# EAGLE design arm controller single v1.1 (EAGLE 9.5.2)
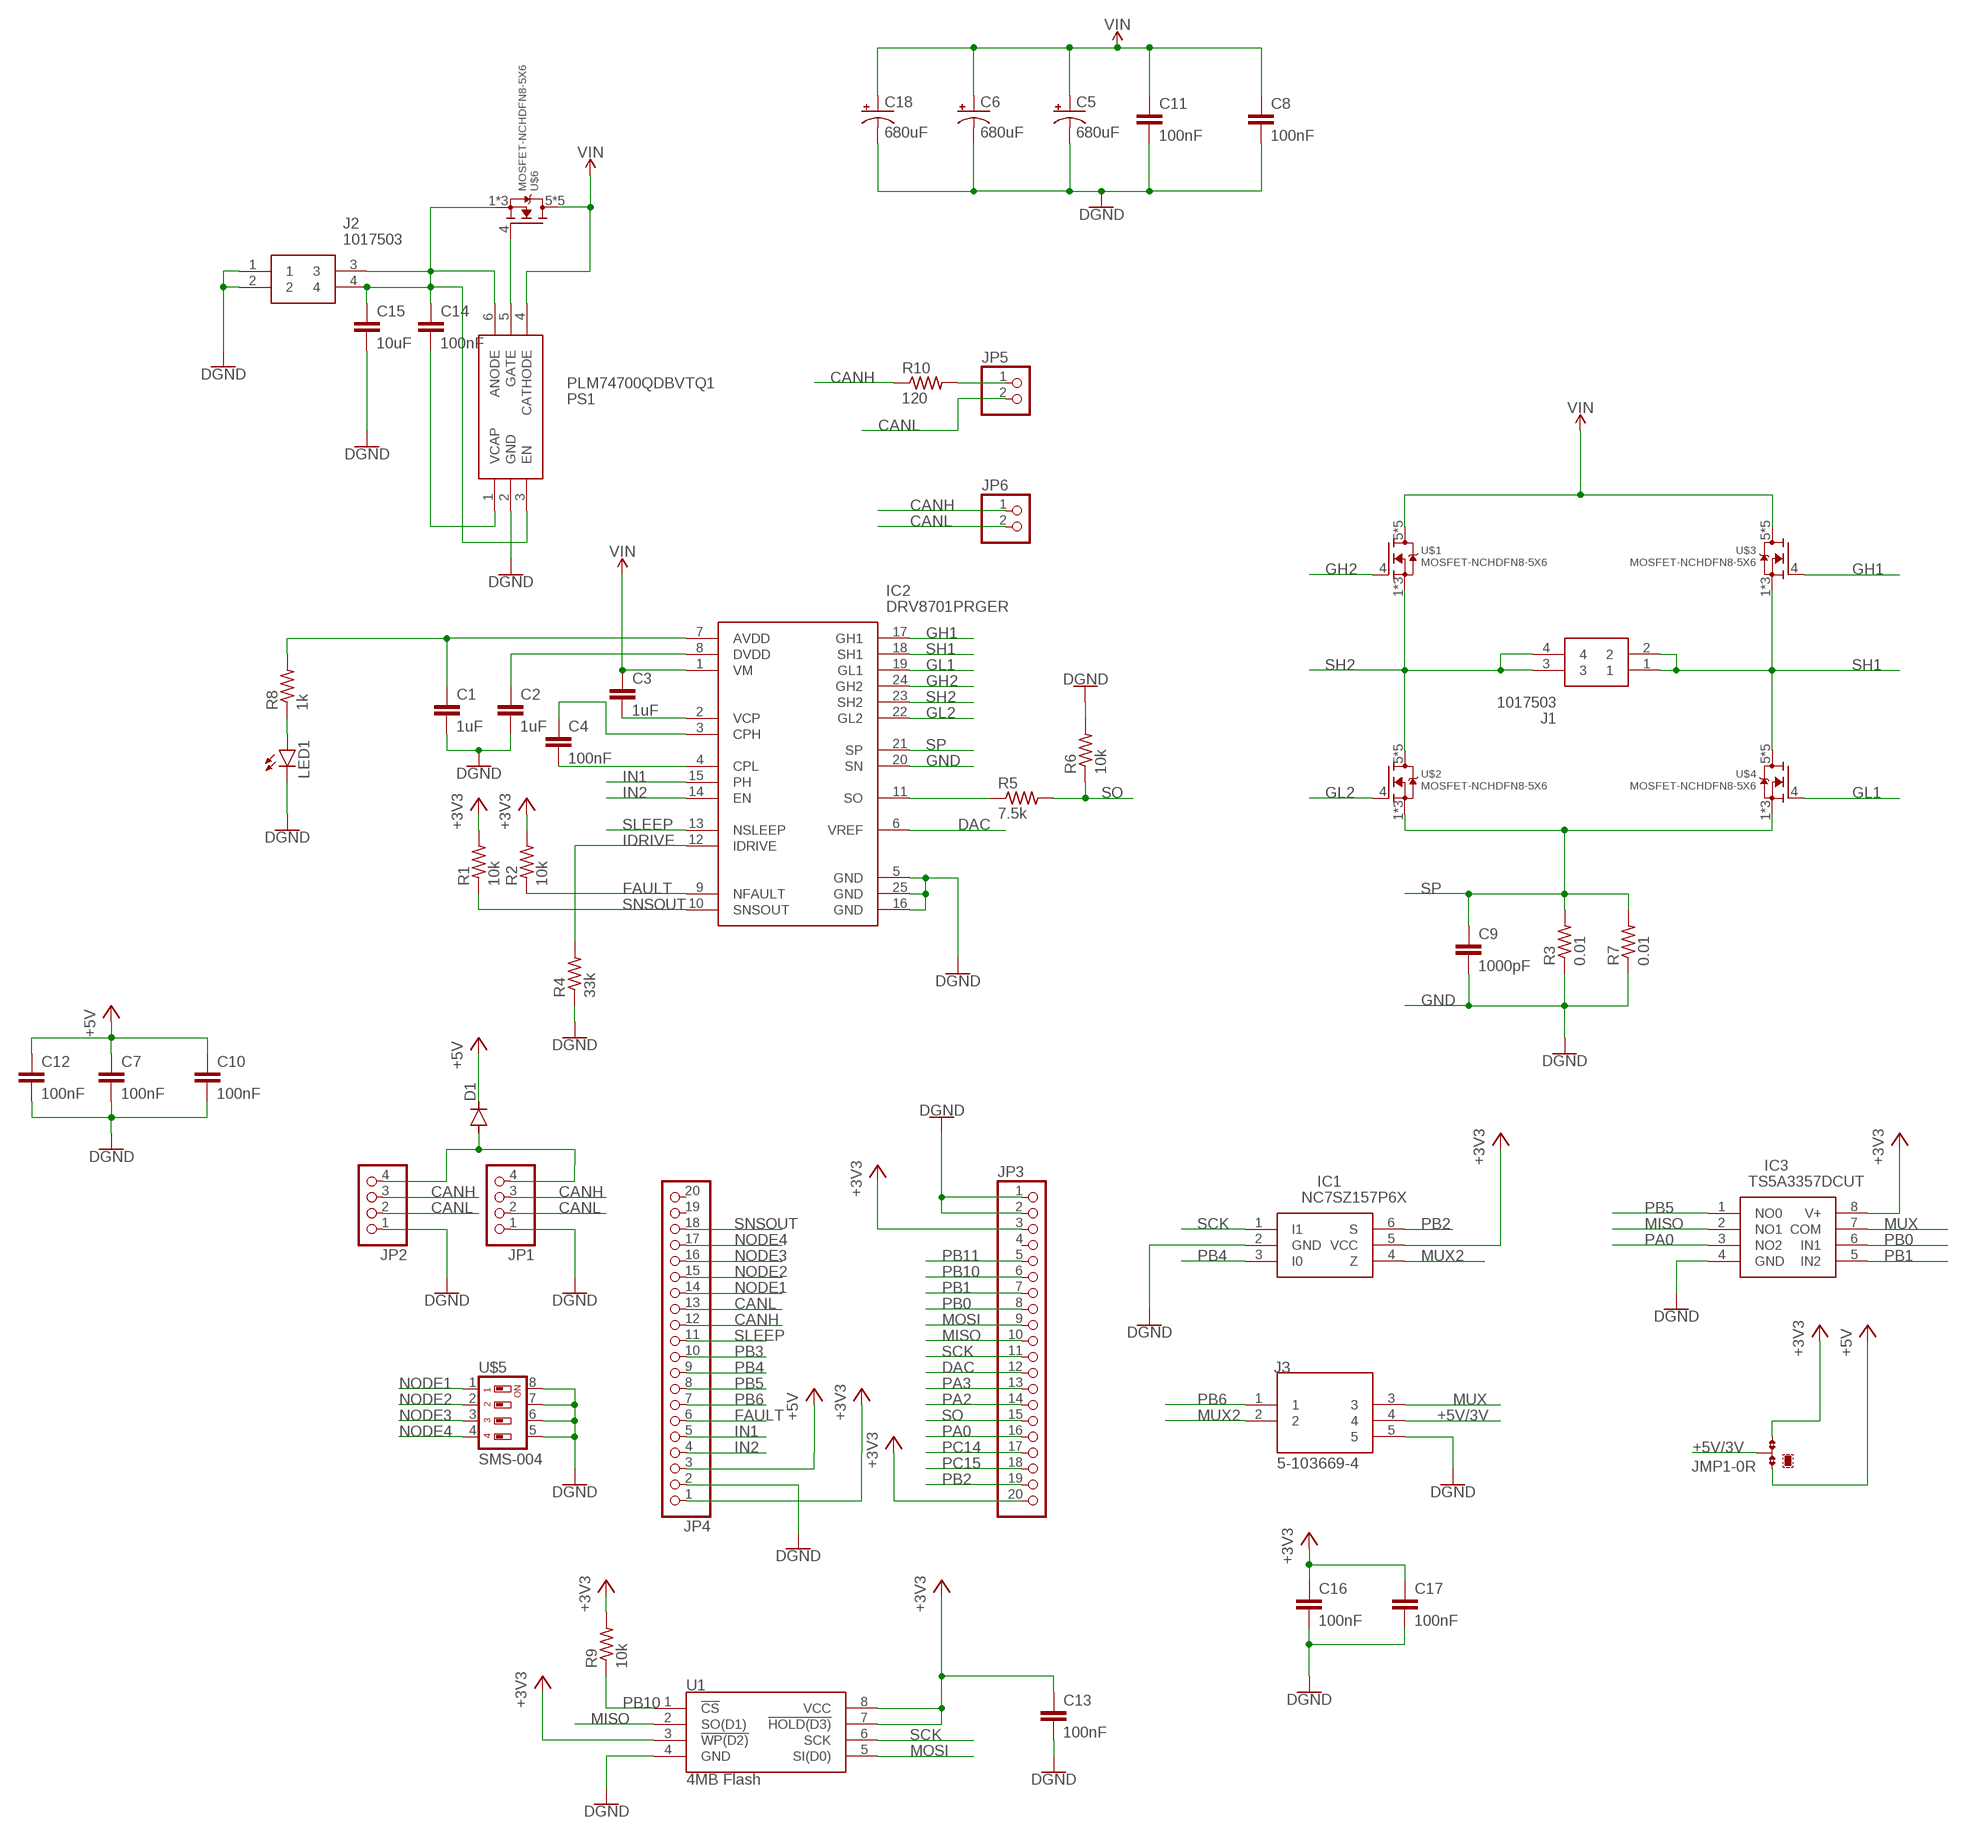
[diagram p0: schematic, sheet 1]

## Parts
C1  1uF  C-EUC0603  [C0603]
C2  1uF  C-EUC0603  [C0603]
C3  1uF  C-EUC0603  [C0603]
C4  100nF  C-EUC0603  [C0603]
C5  680uF  CPOL-USE5-10.5  [E5-10,5]
C6  680uF  CPOL-USE5-10.5  [E5-10,5]
C7  100nF  C-EUC0603  [C0603]
C8  100nF  C-EUC0603  [C0603]
C9  1000pF  C-EUC0603  [C0603]
C10  100nF  C-EUC0603  [C0603]
C11  100nF  C-EUC0603  [C0603]
C12  100nF  C-EUC0603  [C0603]
C13  100nF  C-EUC0603  [C0603]
C14  100nF  C-EUC0603  [C0603]
C15  10uF  C-EUC1206  [C1206]
C16  100nF  C-EUC0603  [C0603]
C17  100nF  C-EUC0603  [C0603]
C18  680uF  CPOL-USE5-10.5  [E5-10,5]
D1  CGRM4001-G  [SOD-123_MINI-SMA]
IC1  NC7SZ157P6X  [SOT65P210X110-6N]
IC2  DRV8701PRGER  [QFN50P400X400X100-25N]
IC3  TS5A3357DCUT  [SOP50P310X90-8N]
J1  1017503  [1017503]
J2  1017503  [1017503]
J3  5-103669-4  [TE_5-103669-4]
JMP1  0R-JUMPB  [B0R-JMP]
JP1  PINHD-1X4  [1X04]
JP2  PINHD-1X4  [1X04]
JP3  PINHD-1X20  [1X20]
JP4  PINHD-1X20  [1X20]
JP5  PINHD-1X2  [1X02]
JP6  PINHD-1X2  [1X02]
LED1  LEDCHIP-LED0805  [CHIP-LED0805]
PS1  PLM74700QDBVTQ1  [SOT95P280X145-6N]
R1  10k  R-US_R0603  [R0603]
R2  10k  R-US_R0603  [R0603]
R3  0.01  R-US_R2512  [R2512]
R4  33k  R-US_R0603  [R0603]
R5  7.5k  R-US_R0603  [R0603]
R6  10k  R-US_R0603  [R0603]
R7  0.01  R-US_R2512  [R2512]
R8  1k  R-US_R0603  [R0603]
R9  10k  R-US_R0603  [R0603]
R10  120  R-US_R0603  [R0603]
U1  4MB Flash  AT25SF041  [SO08]
U$1  MOSFET-NCHDFN8-5X6  [ALOM_DFN5X6_8L_EP1_P]
U$2  MOSFET-NCHDFN8-5X6  [ALOM_DFN5X6_8L_EP1_P]
U$3  MOSFET-NCHDFN8-5X6  [ALOM_DFN5X6_8L_EP1_P]
U$4  MOSFET-NCHDFN8-5X6  [ALOM_DFN5X6_8L_EP1_P]
U$5  SMS-004  [SMS-004]
U$6  MOSFET-NCHDFN8-5X6  [ALOM_DFN5X6_8L_EP1_P]

## Nets
+3V3: C13.1 C16.1 C17.1 IC1.5(VCC) IC3.8(V+) JMP1.3 JP3.3 JP3.20 JP4.1 R1.2 R2.2 R9.2 U1.3(!WP(D2)) U1.7(!HOLD(D3)) U1.8(VCC)
+5V: C7.1 C10.1 C12.1 D1.C JMP1.1 JP4.3
+5V/3V: J3.4 JMP1.2
CANH: JP1.3 JP2.3 JP4.12 JP6.1 R10.1
CANL: JP1.2 JP2.2 JP4.13 JP5.2 JP6.2
DAC: IC2.6(VREF) JP3.12
FAULT: IC2.9(NFAULT) JP4.6 R2.1
GH1: IC2.17(GH1) U$3.4(G)
GH2: IC2.24(GH2) U$1.4(G)
GL1: IC2.19(GL1) U$4.4(G)
GL2: IC2.22(GL2) U$2.4(G)
GND: C1.2 C2.2 C5.- C6.- C7.2 C8.2 C9.2 C10.2 C11.2 C12.2 C13.2 C15.2 C16.2 C17.2 C18.- IC1.2(GND) IC2.5(GND) IC2.16(GND) IC2.20(SN) IC2.25(GND) IC3.4(GND) J2.1 J2.2 J3.5 JP1.1 JP2.1 JP3.1 JP3.2 JP4.2 LED1.C PS1.2(GND) R3.1 R4.1 R6.2 R7.1 U1.4(GND) U$5.5 U$5.6 U$5.7 U$5.8 ; supply symbol labelled DGND
IDRIVE: IC2.12(IDRIVE) R4.2
IN1: IC2.15(PH) JP4.5
IN2: IC2.14(EN) JP4.4
MISO: IC3.2(NO1) JP3.10 U1.2(SO(D1))
MOSI: JP3.9 U1.5(SI(D0))
MUX: IC3.7(COM) J3.3
MUX2: IC1.4(Z) J3.2
N$1: D1.A JP1.4 JP2.4
N$2: LED1.A R8.1
N$3: PS1.5(GATE) U$6.4(G)
N$4: C1.1 IC2.7(AVDD) R8.2
N$5: C2.1 IC2.8(DVDD)
N$6: C3.2 IC2.2(VCP)
N$7: C4.1 IC2.3(CPH)
N$8: C4.2 IC2.4(CPL)
N$10: JP5.1 R10.2
N$11: IC2.11(SO) R5.1
N$12: C14.1 C15.1 J2.3 J2.4 PS1.3(EN) PS1.6(ANODE) U$6.1(S) U$6.2(S) U$6.3(S)
N$13: C14.2 PS1.1(VCAP)
NODE1: JP4.14 U$5.1
NODE2: JP4.15 U$5.2
NODE3: JP4.16 U$5.3
NODE4: JP4.17 U$5.4
PA0: IC3.3(NO2) JP3.16
PA2: JP3.14
PA3: JP3.13
PB0: IC3.6(IN1) JP3.8
PB1: IC3.5(IN2) JP3.7
PB2: IC1.6(S) JP3.19
PB3: JP4.10
PB4: IC1.3(I0) JP4.9
PB5: IC3.1(NO0) JP4.8
PB6: J3.1 JP4.7
PB10: JP3.6 R9.1 U1.1(!CS)
PB11: JP3.5
PC14: JP3.17
PC15: JP3.18
SCK: IC1.1(I1) JP3.11 U1.6(SCK)
SH1: IC2.18(SH1) J1.1 J1.2 U$3.1(S) U$3.2(S) U$3.3(S) U$4.5(D) U$4.6(D) U$4.7(D) U$4.8(D) U$4.9(D)
SH2: IC2.23(SH2) J1.3 J1.4 U$1.1(S) U$1.2(S) U$1.3(S) U$2.5(D) U$2.6(D) U$2.7(D) U$2.8(D) U$2.9(D)
SLEEP: IC2.13(NSLEEP) JP4.11
SNSOUT: IC2.10(SNSOUT) JP4.18 R1.1
SO: JP3.15 R5.2 R6.1
SP: C9.1 IC2.21(SP) R3.2 R7.2 U$2.1(S) U$2.2(S) U$2.3(S) U$4.1(S) U$4.2(S) U$4.3(S)
VIN: C3.1 C5.+ C6.+ C8.1 C11.1 C18.+ IC2.1(VM) PS1.4(CATHODE) U$1.5(D) U$1.6(D) U$1.7(D) U$1.8(D) U$1.9(D) U$3.5(D) U$3.6(D) U$3.7(D) U$3.8(D) U$3.9(D) U$6.5(D) U$6.6(D) U$6.7(D) U$6.8(D) U$6.9(D)
Unconnected: JP3.4 JP4.19 JP4.20

## Library data of the parts
C1-C4 C7-C17 = rcl:C-EU: CAPACITOR, European symbol; SPICEPREFIX: C
C5 C6 C18 = rcl:CPOL-US: POLARIZED CAPACITOR, American symbol; SPICEPREFIX: C
D1 = diode:CGRM400*-G: Molded plasitc,JEDEC SOD-123/Mini SMA Source: Comchip CGRM4001-G.pdf
IC1 = SPEAR:NC7SZ157P6X: NC7SZ157P6X, Multiplexer Switch IC Single 2 x 1, 1.65 5.5 V, 6-Pin, SC-70, 1 Source: Datasheet <https://componentsearchengine.com/Datasheets/1/NC7SZ157P6X.pdf>; DESCRIPTION: NC7SZ157P6X, Multiplexer Switch IC Single 2 x 1, 1.65 5.5 V, 6-Pin, SC-70, 1; HEIGHT: 1.1mm; MANUFACTURER_NAME: ON Semiconductor; MANUFACTURER_PART_NUMBER: NC7SZ157P6X; MOUSER_PART_NUMBER: 512-NC7SZ157P6X; MOUSER_PRICE-STOCK: https://www.mouser.com/Search/Refine.aspx?Keyword=512-NC7SZ157P6X
IC2 = SPEAR:DRV8701PRGER: Motor / Motion / Ignition Controllers & Drivers Brushed DC Motor Gate Driver (PH/EN, PWM Ctrl) 24-VQFN -40 to 125 Source: Datasheet <http://www.ti.com/lit/ds/symlink/drv8701.pdf>; DESCRIPTION: Motor / Motion / Ignition Controllers & Drivers Brushed DC Motor Gate Driver (PH/EN, PWM Ctrl) 24-VQFN -40 to 125; HEIGHT: 1mm; MANUFACTURER_NAME: Texas Instruments; MANUFACTURER_PART_NUMBER: DRV8701PRGER; MOUSER_PART_NUMBER: 595-DRV8701PRGER; MOUSER_PRICE-STOCK: https://www.mouser.com/Search/Refine.aspx?Keyword=595-DRV8701PRGER
IC3 = SPEAR:TS5A3357DCUT: Single 5-Ohm SP3T Analog Switch 5-V/3.3-V 3:1 Analog Multiplexer/Demultiplexer Source: Datasheet <http://www.ti.com/lit/ds/symlink/ts5a3357.pdf>; DESCRIPTION: Single 5-Ohm SP3T Analog Switch 5-V/3.3-V 3:1 Analog Multiplexer/Demultiplexer; HEIGHT: 0.9mm; MANUFACTURER_NAME: Texas Instruments; MANUFACTURER_PART_NUMBER: TS5A3357DCUT; MOUSER_PART_NUMBER: 595-TS5A3357DCUT; MOUSER_PRICE-STOCK: https://www.mouser.com/Search/Refine.aspx?Keyword=595-TS5A3357DCUT
J1 J2 = SPEAR:1017503: Phoenix Contact TDPT Series 5.08mm Pitch, PCB Terminal Block, PCB Mount, 2 Way Source: Datasheet <https://www.phoenixcontact.com/online/portal/gb?uri=pxc-oc-itemdetail:pid=1017503&library=gben&tab=1>; ALLIED_NUMBER: 71241708; ALLIED_PRICE-STOCK: https://www.alliedelec.com/phoenixcontact-1017503/71241708/; DESCRIPTION: Phoenix Contact TDPT Series 5.08mm Pitch, PCB Terminal Block, PCB Mount, 2 Way; HEIGHT: 19.2mm; MANUFACTURER_NAME: Phoenix Contact; MANUFACTURER_PART_NUMBER: 1017503; MOUSER_PART_NUMBER: 651-1017503; MOUSER_PRICE-STOCK: https://www.mouser.com/Search/Refine.aspx?Keyword=651-1017503; RS_PART_NUMBER: 1753905; RS_PRICE-STOCK: http://uk.rs-online.com/web/p/products/1753905
J3 = SPEAR:5-103669-4: 05 MTE HDR SRST LATCH W/HLDWN; AVAILABILITY: Unavailable; CENTERLINE_PITCH: 2.54 mm[.1 in]; COMMENT: 5-103669-4; DESCRIPTION: 05 MTE HDR SRST LATCH W/HLDWN; EU_ROHS_COMPLIANCE: Compliant; LINK: http://www.te.com/usa-en/product-5-103669-4.html; MF: TE Connectivity; MP: 5-103669-4; NUMBER_OF_POSITIONS: 5; PACKAGE: None; PRICE: None; PRODUCT_TYPE: Connector
JMP1 = jump-0r-smd:0R-JUMP: SMD 0R 0805 Jumper
JP1 JP2 = pinhead:PINHD-1X4: PIN HEADER
JP3 JP4 = pinhead:PINHD-1X20: PIN HEADER
JP5 JP6 = pinhead:PINHD-1X2: PIN HEADER
LED1 = led:LED: LED OSRAM: - CHIPLED LG R971, LG N971, LY N971, LG Q971, LY Q971, LO R971, LY R971 LH N974, LH R974 LS Q976, LO Q976, LY Q976 LO Q996 - Hyper CHIPLED LW Q18S LB Q993, LB Q99A, LB R99A - SideLED LS A670, LO A670, LY A670, LG A670, LP A670 LB A673, LV A673, LT A673, LW A673 LH A674 LY A675 LS A676, LA A676, LO A676, LY A676, LW A676 LS A679, LY A679, LG A679 - Hyper Micro SIDELED® LS Y876, LA Y876, LO Y876, LY Y876 LT Y87S - SmartLED LW L88C, LW L88S LB L89C, LB L89S, LG L890 LS L89K, LO L89K, LY L89K LS L896, LA L896, LO L896, LY L896 - TOPLED LS T670, LO T670, LY T670, LG T670, LP T670 LSG T670, LSP T670, LSY T670, LOP T670, LYG T670 LG T671, LOG T671, LSG T671 LB T673, LV T673, LT T673, LW T673 LH T674 LS T676, LA T676, LO T676, LY T676, LB T676, LH T676, LSB T676, LW T676 LB T67C, LV T67C, LT T67C, LS T67K, LO T67K, LY T67K, LW E67C LS E67B, LA E67B, LO E67B, LY E67B, LB E67C, LV E67C, LT E67C LW T67C LS T679, LY T679, LG T679 LS T770, LO T770, LY T770, LG T770, LP T770 LB T773, LV T773, LT T773, LW T773 LH T774 LS E675, LA E675, LY E675, LS T675 LS T776, LA T776, LO T776, LY T776, LB T776 LHGB T686 LT T68C, LB T68C - Hyper Mini TOPLED® LB M676 - Mini TOPLED Santana® LG M470 LS M47K, LO M47K, LY M47K Source: http://www.osram.convergy.de LUXEON: - LUMILED® LXK2-PW12-R00, LXK2-PW12-S00, LXK2-PW14-U00, LXK2-PW14-V00 LXK2-PM12-R00, LXK2-PM12-S00, LXK2-PM14-U00 LXK2-PE12-Q00, LXK2-PE12-R00, LXK2-PE12-S00, LXK2-PE14-T00, LXK2-PE14-U00 LXK2-PB12-K00, LXK2-PB12-L00, LXK2-PB12-M00, LXK2-PB14-N00, LXK2-PB14-P00, LXK2-PB14-Q00 LXK2-PR12-L00, LXK2-PR12-M00, LXK2-PR14-Q00, LXK2-PR14-R00 LXK2-PD12-Q00, LXK2-PD12-R00, LXK2-PD12-S00 LXK2-PH12-R00, LXK2-PH12-S00 LXK2-PL12-P00, LXK2-PL12-Q00, LXK2-PL12-R00 Source: www.luxeon.com KINGBRIGHT: KA-3528ASYC Source: www.kingbright.com
PS1 = SPEAR:PLM74700QDBVTQ1: Low Iq, Always On Smart Diode Controller Source: Datasheet <http://www.ti.com/lit/gpn/lm74700-q1>; DESCRIPTION: Low Iq, Always On Smart Diode Controller; HEIGHT: 1.45mm; MANUFACTURER_NAME: Texas Instruments; MANUFACTURER_PART_NUMBER: PLM74700QDBVTQ1; MOUSER_PART_NUMBER: 595-PLM74700QDBVTQ1; MOUSER_PRICE-STOCK: https://www.mouser.com/Search/Refine.aspx?Keyword=595-PLM74700QDBVTQ1
R1-R10 = rcl:R-US_: RESISTOR, American symbol; SPICEPREFIX: R
U1 = LCSC:AT25SF041: AT25SF041 4Mb Serial Flash Memory 104MHz, SPI, 8-SOIC Datasheet <http://www.adestotech.com/wp-content/uploads/DS-AT25SF041_044.pdf> SparkFun Products: SparkFun ESP8266 Thing <https://www.sparkfun.com/products/13231> SparkFun ESP8266 Thing - Dev Board <https://www.sparkfun.com/products/13711>; PROD_ID: IC-12455
U$1-U$4 U$6 = SPEAR:MOSFET-NCH: N-Channel MOSFET like the IPB80N03S4L-03.
U$5 = SPEAR:SMS-004

## Board
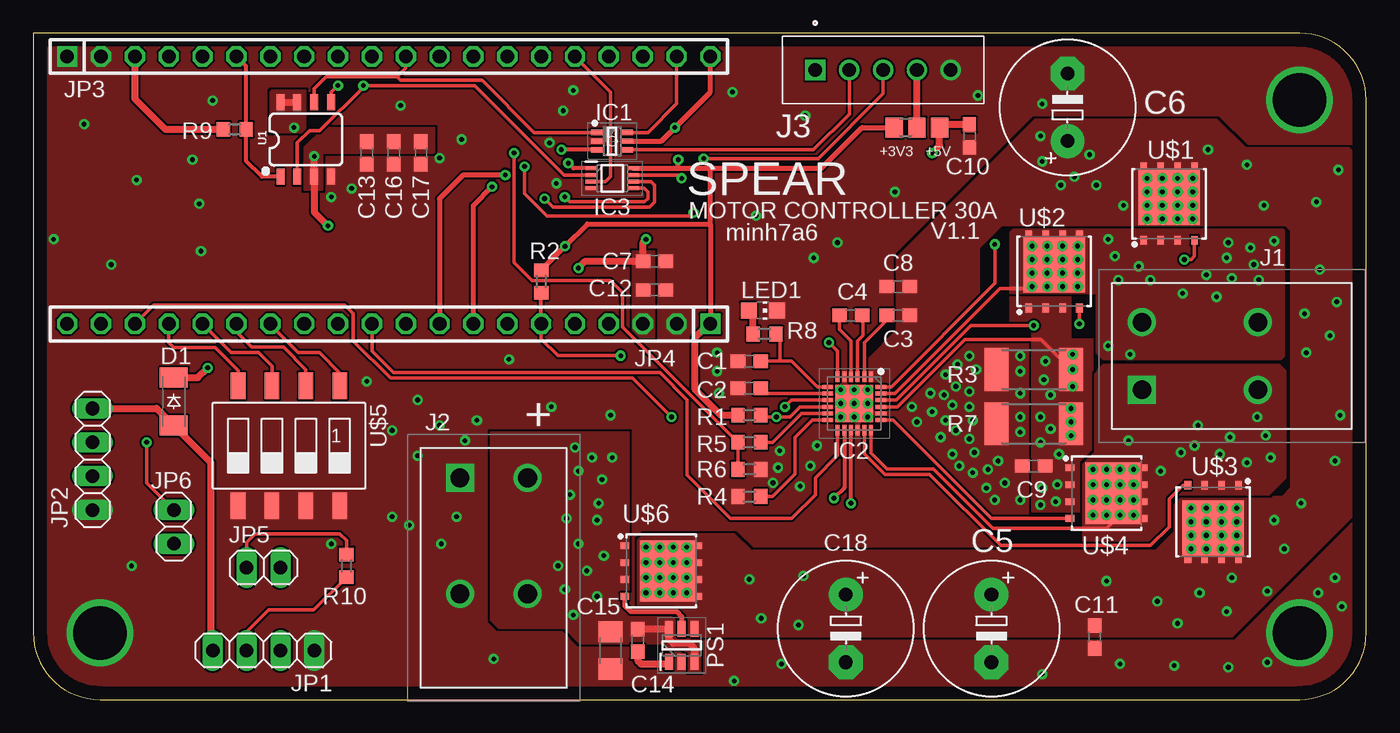
[diagram p1: board, top side]
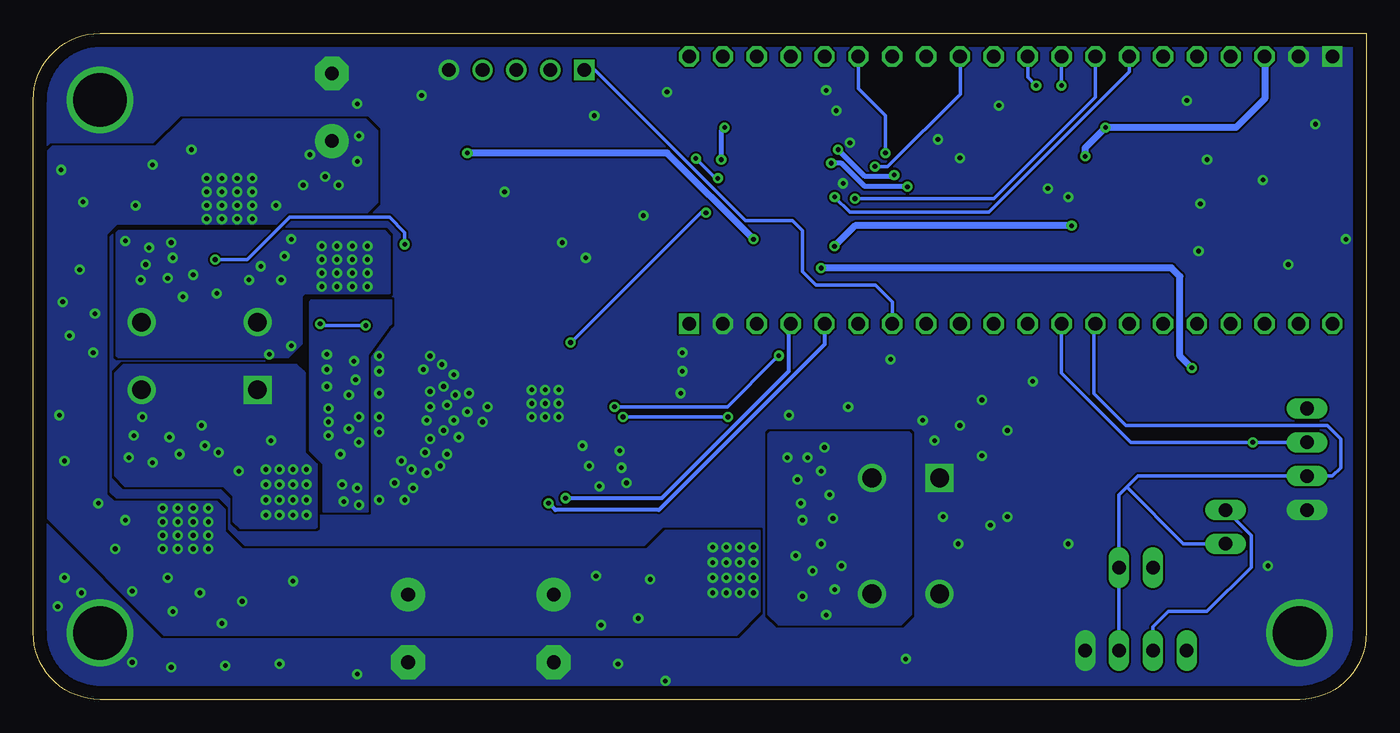
[diagram p2: board, bottom side, seen from below]

Size 100 x 50 mm. Coordinates in mm from the lower left corner, seen from the top.
Outline: 0,50 0,5 arc90 5,0 95,0 arc90 100,5 100,45 arc90 95,50 0,50
Copper layers (1*16): Top 0.035mm / dielectric 1.5mm / Bottom 0.035mm
Design rules "default *": minimum track width 6mil, minimum drill 0.35mm, track to track 6mil, track to pad 6mil, pad to pad 6mil, via to via 6mil, smd to smd 6mil, copper to edge 40mil, drill to drill 6mil, minimum pad ring 10mil, minimum via ring 8mil, stop-mask expansion 4mil, vias tented up to drill 20mil, thermal gap 10mil

### Footprints (pad centres in the part's own frame; a part is rotated, then mirrored left to right if it is on the bottom)
C0603 = smd 1.1 x 1: 1 -0.85,0; 2 0.85,0
E5-10,5 = drill 1.016 pad 2.54: + -2.54,0 | drill 1.016 pad 2.54 octagon: - 2.54,0
C1206 = smd 1.6 x 1.8: 1 -1.4,0; 2 1.4,0
SOD-123_MINI-SMA = smd 1.5 x 2.1: A 1.8,0; C -1.8,0
SOT65P210X110-6N = smd 0.95 x 0.4: 1 -1.1,0.65; 2 -1.1,0; 3 -1.1,-0.65; 4 1.1,-0.65; 5 1.1,0; 6 1.1,0.65
QFN50P400X400X100-25N = smd 0.8 x 0.3: 1 -2,1.25; 2 -2,0.75; 3 -2,0.25; 4 -2,-0.25; 5 -2,-0.75; 6 -2,-1.25; 13 2,-1.25; 14 2,-0.75; 15 2,-0.25; 16 2,0.25; 17 2,0.75; 18 2,1.25 | smd 0.3 x 0.8: 7 -1.25,-2; 8 -0.75,-2; 9 -0.25,-2; 10 0.25,-2; 11 0.75,-2; 12 1.25,-2; 19 1.25,2; 20 0.75,2; 21 0.25,2; 22 -0.25,2; 23 -0.75,2; 24 -1.25,2 | smd 2.8 x 2.8: 25 0,0
SOP50P310X90-8N = smd 0.85 x 0.3: 1 -1.575,0.75; 2 -1.575,0.25; 3 -1.575,-0.25; 4 -1.575,-0.75; 5 1.575,-0.75; 6 1.575,-0.25; 7 1.575,0.25; 8 1.575,0.75
1017503 = drill 1.4 pad 2.1 square: 1 0,0 | drill 1.4 pad 2.1: 2 0,-8.7; 3 5.08,0; 4 5.08,-8.7
TE_5-103669-4 = drill 1.02 square: 1 -5.08,0 | drill 1.02: 2 -2.54,0; 3 0,0; 4 2.54,0; 5 5.08,0
B0R-JMP = smd 1.5 x 1.3: 1 0,1.7; 2 0,0; 3 0,-1.7
1X04 = drill 1.016 long: 1 -3.81,0; 2 -1.27,0; 3 1.27,0; 4 3.81,0
1X20 = drill 1.016 square: 1 -24.13,0 | drill 1.016 octagon: 2 -21.59,0; 3 -19.05,0; 4 -16.51,0; 5 -13.97,0; 6 -11.43,0; 7 -8.89,0; 8 -6.35,0; 9 -3.81,0; 10 -1.27,0; 11 1.27,0; 12 3.81,0; 13 6.35,0; 14 8.89,0; 15 11.43,0; 16 13.97,0; 17 16.51,0; 18 19.05,0; 19 21.59,0; 20 24.13,0
1X02 = drill 1.016 long: 1 -1.27,0; 2 1.27,0
CHIP-LED0805 = smd 1.2 x 1.2: A 0,-1.05; C 0,1.05
SOT95P280X145-6N = smd 1.2 x 0.6: 1 -1.25,0.95; 2 -1.25,0; 3 -1.25,-0.95; 4 1.25,-0.95; 5 1.25,0; 6 1.25,0.95
R0603 = smd 1 x 1.1: 1 -0.85,0; 2 0.85,0
R2512 = smd 1.8 x 3.2: 1 -2.8,0; 2 2.8,0
SO08 = smd 0.6 x 1.2: 1 -1.905,-2.8; 2 -0.635,-2.8; 3 0.635,-2.8; 4 1.905,-2.8; 5 1.905,2.8; 6 0.635,2.8; 7 -0.635,2.8; 8 -1.905,2.8
ALOM_DFN5X6_8L_EP1_P = smd 0.65 x 0.5: 1 -2.75,1.905; 2 -2.75,0.635; 3 -2.75,-0.635; 4 -2.75,-1.905 | smd 0.55 x 0.5: 5 2.795,-1.905; 6 2.795,-0.635; 7 2.795,0.635; 8 2.795,1.905 | smd 4.12 x 4.6: 9 0.46,0
SMS-004 = smd 1.092 x 2.007: 1 -3.81,-4.496; 2 -1.27,-4.496; 3 1.27,-4.496; 4 3.81,-4.496; 5 3.81,4.496; 6 1.27,4.496; 7 -1.27,4.496; 8 -3.81,4.496

### Placement (x,y rotation side)
C1  53.72,25.4 180 top
C2  53.72,23.37 180 top
C3  64.9,28.83 180 top
C4  61.34,28.83 180 top
C5  71.88,5.33 270 top
C6  77.6,44.45 90 top
C7  46.61,32.89 0 top
C8  64.9,30.99 180 top
C9  75.06,17.53 180 top
C10  70.23,42.29 270 top
C11  79.63,4.7 270 top
C12  46.61,30.73 0 top
C13  25.02,41.02 270 top
C14  45.34,4.45 270 top
C15  43.31,3.68 270 top
C16  27.05,41.02 270 top
C17  29.08,41.02 270 top
C18  60.96,5.33 270 top
D1  10.54,22.35 270 top
IC1  43.43,41.91 0 top
IC2  61.59,22.23 270 top
IC3  43.43,39.12 0 top
J1  83.19,23.24 90 top
J2  32,16.64 0 top
J3  63.75,47.24 0 top
JMP1  66.29,42.93 270 top
JP1  17.27,3.68 180 top
JP2  4.45,18.03 90 top
JP3  26.67,48.26 0 top
JP4  26.67,28.19 180 top
JP5  17.27,9.91 0 top
JP6  10.54,12.95 270 top
LED1  54.74,29.21 270 top
PS1  48.64,4.06 90 top
R1  53.72,21.34 180 top
R2  38.1,31.37 90 top
R3  75.06,24.77 0 top
R4  53.72,15.24 0 top
R5  53.72,19.3 180 top
R6  53.72,17.27 0 top
R7  75.06,20.7 0 top
R8  54.86,27.43 0 top
R9  15.11,42.8 180 top
R10  23.5,10.03 90 top
U1  20.45,42.04 0 top
U$1  85.22,37.21 90 top
U$2  76.58,32.13 90 top
U$3  88.52,13.34 270 top
U$4  80.52,15.49 0 top
U$5  19.18,19.05 180 top
U$6  47.12,9.65 0 top

### Tracks (layer width: path | path; a pad name or v marks a point on that pad's centre or on a via)
+3V3  (via drill 0.35)
  Top 0.381: IC1.5 47.12,41.91 v48.13,42.93 50.8,45.59 JP3.20 | IC3.8 48.39,39.87 | 50.8,35.69 50.8,28.32 JP4.1 | R2.2 v39.9,34.02 41.57,35.69 50.8,35.69 | 48.39,39.87 v48.39,40.51 | JMP1.3 62.18,42.93 59.12,39.87 50.8,39.87 | 48.39,39.87 50.8,39.87 | 50.8,35.69 50.8,39.87
  Top 0.508: R1.2 51.6,21.34 49.66,23.28 49.66,27.18 50.8,28.32 | JP3.3 7.62,45.09 9.91,42.8 R9.2 | U1.8 U1.7 | v21.08,40.77 U1.3 21.08,36.58 v22.1,35.56
  Bottom 0.381: v48.39,40.51 48.39,42.67 v48.13,42.93
  Bottom 0.508: JP3.3 7.62,45.09 9.78,42.93 v19.56,42.93 21.08,41.4 v21.08,40.77 | v39.9,34.02 38.35,35.56 v22.1,35.56
  pour Top (no thermals): 17.78,45.59 17.78,42.55 20.45,42.55 20.45,45.72 17.91,45.72
  pour Top (no thermals): 20.32,41.4 20.32,38.23 21.72,38.23 21.72,41.02 30.1,41.02 30.1,42.93 21.84,42.93
+5V  (via drill 0.35)
  Top 0.508: C10.1 68.21,43.14 JMP1.1 67.99,41.58 v67.44,41.02 | v45.97,34.54 45.76,34.33 C7.1 41.4,32.89 v40.89,32.38 | D1.C 12.34,24.15 v13.08,24.89
  Bottom 0.508: v45.97,34.54 52.45,41.02 v67.44,41.02 | v13.08,24.89 13.97,25.78 13.97,31.75 14.61,32.38 v40.89,32.38
  pour Top (no thermals): 46.61,33.66 46.61,27.18 44.96,27.18 44.96,33.66
+5V/3V
  Top 0.508: JMP1.2 J3.4
CANH  (via drill 0.35)
  Top 0.254: v8.51,19.3 8.51,16.26 JP6.1 | R10.1 21.04,6.73 17.65,6.73 16,5.08 JP1.3
  Bottom 0.254: JP4.12 22.86,24.51 17.65,19.3 v8.51,19.3 JP2.3 | JP6.1 8.64,12.32 8.64,9.91 11.94,6.6 14.86,6.6 16,5.46 JP1.3
CANL
  Bottom 0.254: JP4.13 20.45,28.07 20.45,22.99 18.03,20.57 2.92,20.57 1.91,19.56 1.91,17.4 2.54,16.76 JP2.2 17.14,16.76 17.97,15.94 | 17.97,15.94 18.54,15.37 JP5.2 JP1.2 | JP6.2 13.72,11.68 17.97,15.94
DAC  (via drill 0.35)
  Top 0.254: v36.85,40.01 36.85,37.97 38.54,36.28 49.28,36.28 v49.53,36.53 | v59.69,26.8 60.34,26.14 IC2.6
  Bottom 0.254: v36.85,40.01 35.9,40.01 30.46,45.45 30.46,48.24 JP3.12 | v49.53,36.53 49.91,36.53 59.65,26.8 v59.69,26.8
FAULT  (via drill 0.35)
  Top 0.254: IC2.9 56.89,22.48 v56.39,21.97 | v44.07,25.8 39.35,25.8 38.1,27.05 JP4.6
  Top 0.305: JP4.6 R2.1
  Bottom 0.254: v44.07,25.8 44.32,25.55 44.34,25.55 47.92,21.97 v56.39,21.97
GH1
  Top 0.254: U$3.4 86.23,16.09 85.22,15.07 85.22,12.95 83.82,11.56 72.58,11.56 67.24,16.89 63.88,16.89 62.34,18.43 IC2.17
GH2  (via drill 0.35)
  Top 0.254: U$1.4 87.12,33.27 86.87,33.02 v86.36,33.02 | IC2.24 64.37,23.48 72.14,31.24 v72.14,34.16
  Bottom 0.254: v86.36,33.02 83.95,33.02 80.77,36.2 73.28,36.2 72.14,35.05 v72.14,34.16
GL1
  Top 0.254: IC2.19 64.5,20.98 71.88,13.59 U$4.4
GL2  (via drill 0.35)
  Top 0.254: U$2.4 v78.49,28.19 | v75.06,28.07 70.36,28.07 64.77,22.48 IC2.22
  Bottom 0.254: v78.49,28.19 78.36,28.07 v75.06,28.07
GND  (via drill 0.35, 4)
  other vias: 5,5 95,5 95,45 60.58,23.24 61.59,23.24 62.61,23.24 62.61,22.23 62.61,21.21 61.59,22.23 60.58,22.23 60.58,21.21 61.59,21.21 70.23,25.78 74.04,25.78 74.04,24.64 74.04,22.99 74.04,21.21 74.04,20.07 72.39,17.91 72.9,16.26 74.04,14.99 72.14,14.99 70.48,17.02 71.5,15.88 70.61,18.54 70.48,20.95 70.23,23.11 70.74,24.77 68.45,24.38 68.96,22.1 67.31,22.99 65.91,21.97 66.29,20.83 67.44,21.59 69.22,20.19 68.07,19.68 68.96,18.41 70.23,19.56 69.47,17.53 71.63,17.27 69.22,23.5 69.34,25.15 68.33,22.86 70.23,21.97 68.45,20.95 39.75,44.2 40.51,45.72 38.73,41.78 39.24,38.73 30.48,40.64 23.88,38.35 22.35,37.72 12.45,37.21 5.84,32.64 28.83,18.29 28.19,13.08 30.61,11.68 33.27,20.95 38.86,21.97 35.69,25.53 30.48,20.57 26.92,13.72 22.35,11.68 51.31,26.04 51.31,24.64 51.44,22.99 56.01,18.67 55.88,17.4 55.5,16.26 58.8,19.05 58.29,17.53 57.53,16 58.55,33.15 60.33,34.29 64.64,38.1 54.23,36.32 52.45,45.59 57.91,43.81 70.87,45.34 75.69,44.7 26.92,20.19 28.83,22.48 25.02,23.88 31.75,13.72 32.38,19.43 12.57,33.66 3.81,43.18 1.52,34.54 7.75,38.99 11.94,40.51 13.46,44.96 27.56,44.58 32.13,42.04 7.37,10.03 43.31,21.34 56.13,2.67 52.58,1.4 34.54,3.05 75.69,1.91 81.53,2.67 89.66,2.41 97.66,9.14 92.58,2.79 85.6,2.54 98.17,6.99 96.39,8
  pour Top (rank 6, no thermals): -2.54,50.8 -2.54,-2.54 101.6,-2.54 101.6,52.07 -2.54,52.07
  pour Bottom (rank 6, no thermals): -1.27,50.8 -1.27,-1.27 100.33,-1.27 100.33,50.8
IDRIVE
  Top 0.254: R4.2 55.46,15.24 57.15,16.93 57.15,19.68 58.44,20.98 IC2.12
IN1  (via drill 0.35)
  Top 0.305: v61.34,14.73 IC2.15
  Bottom 0.305: JP4.5 40.64,26.66 53.07,14.22 60.83,14.22 v61.34,14.73
IN2  (via drill 0.35)
  Top 0.305: IC2.14 60.84,15.89 v60.07,15.11
  Bottom 0.305: v60.07,15.11 52.83,15.11 43.31,24.64 43.31,28.07 JP4.4
MISO  (via drill 0.35)
  Top 0.254: IC3.2 39.82,39.37 33.11,46.08 v24.77,46.08 24.77,45.95 21.5,42.69 20.72,42.69 19.81,41.78 U1.2
  Bottom 0.254: v24.77,46.08 25.4,46.71 JP3.10
MOSI  (via drill 0.35)
  Top 0.254: U1.5 22.35,45.57 v22.86,46.08
  Bottom 0.254: v22.86,46.08 JP3.9
MUX  (via drill 0.35)
  Top 0.254: IC3.7 48.39,39.37 v48.64,39.12 | v50.29,40.6 58.89,40.6 63.75,45.47 J3.3
  Bottom 0.254: v48.64,39.12 48.81,39.12 v50.29,40.6
MUX2
  Top 0.254: IC1.4 58.53,41.26 61.21,43.94 J3.2
N$1
  Top 0.508: JP2.4 9.25,21.84 D1.A 13.34,17.76 13.34,3.81 JP1.4
N$2
  Top 0.508: R8.1 53.94,27.5 53.94,28.96 LED1.A
N$3
  Top 0.381: U$6.4 44.37,7.07 44.83,6.6 48.26,6.6 48.64,6.22 PS1.5
N$4
  Top 0.254: IC2.7 58.82,23.48 56.9,25.4 56.01,25.4 | 56.01,25.4 C1.1 | 56.01,25.4 56.01,27.14 R8.2
N$5
  Top 0.254: IC2.8 54.96,22.98 C2.1
N$6
  Top 0.254: IC2.2 62.34,26.79 64.05,28.49 C3.2
N$7
  Top 0.254: IC2.3 61.84,26.92 62.23,27.3 62.23,28.79 C4.1
N$8
  Top 0.254: IC2.4 61.34,26.92 60.49,27.77 C4.2
N$10
  Top 0.254: R10.2 23.5,11.94 22.99,12.45 16.64,12.45 16,11.81 JP5.1
N$11
  Top 0.254: R5.1 55.46,19.3 57.63,21.48 IC2.11
N$12  (via drill 0.35)
  Top 0.508: C14.1 47.67,5.29 PS1.6 47.69,4.54 48.02,4.2 49.24,4.2 49.6,3.84 49.6,2.82 PS1.3
  other vias: 40.89,17.14 43.43,18.16 42.29,13.46 40.89,11.68 41.53,9.65 42.29,7.75 42.8,10.79 40.26,15.37 42.67,16.51 41.91,18.16 40.01,13.59 39.37,10.03 39.88,8.26 42.42,14.73 40.51,6.35 40.64,18.92
  pour Top (rank 2, no thermals): 34.92,5.33 39.88,5.33 41.02,4.19 47.37,4.19 47.75,3.81 48.77,3.81 49.15,3.43 49.15,2.03 50.04,2.03 50.04,4.32 49.78,4.57 48.39,4.57 48.13,4.83 48.13,5.97 47.88,6.22 45.47,6.22 44.7,6.99 44.7,20.07 34.29,20.07 34.29,5.97
  pour Bottom (no thermals): 34.16,19.94 34.16,6.35 34.92,5.59 44.07,5.59 44.83,6.35 44.83,19.94 44.7,20.07 34.29,20.07
N$13
  Top 0.508: C14.2 45.34,2.92 45.59,2.67 47.54,2.67 PS1.1
NODE1
  Top 0.254: JP4.14 17.78,28.13 19.88,26.04 21.46,26.04 22.99,24.51 U$5.1
NODE2
  Top 0.254: U$5.2 20.45,24.77 18.77,26.44 16.38,26.44 15.24,27.58 JP4.15
NODE3
  Top 0.254: JP4.16 14.86,26.04 16.89,26.04 17.91,25.02 U$5.3
NODE4
  Top 0.254: U$5.4 15.37,24.69 13.64,26.42 10.54,26.42 10.16,26.8 JP4.17
PA0
  Top 0.254: IC3.3 42.93,38.87 43.31,39.24 43.31,45.59 JP3.16
PB0  (via drill 0.35)
  Top 0.254: IC3.6 46.35,38.87 46.61,38.61 46.61,37.34 46.23,36.96 38.99,36.96 v38.35,37.59
  Bottom 0.254: v38.35,37.59 27.94,37.59 20.32,45.21 JP3.8
PB1  (via drill 0.35)
  Top 0.254: IC3.5 45.84,38.37 46.1,38.1 46.1,37.59 45.87,37.36 40.23,37.36 v39.88,37.72
  Bottom 0.254: v39.88,37.72 38.73,36.58 28.32,36.58 17.78,47.12 JP3.7
PB2
  Top 0.254: IC1.6 46.12,42.56 48.26,44.7 JP3.19
PB4  (via drill 0.35)
  Top 0.305: IC1.3 39.64,41.26 v39.62,41.27
  Top 0.381: v35.41,39.37 32.26,39.37 30.48,37.59 JP4.9
  Bottom 0.381: v35.41,39.37 35.5,39.28 37.63,39.28 v39.62,41.27
PB5  (via drill 0.35)
  Top 0.305: IC3.1 40.52,39.87 v40.14,40.25
  Top 0.381: JP4.8 33.02,37.08 v34.42,38.48
  Bottom 0.381: v40.14,40.25 39.35,40.25 37.62,38.52 34.46,38.52 v34.42,38.48
PB6
  Bottom 0.254: J3.1 57.86,47.24 46.56,35.94 43.05,35.94 42.29,35.18 42.29,32.13 41.27,31.11 36.83,31.11 35.56,29.84 JP4.7
PB10
  Top 0.305: U1.1 17.15,39.24 15.96,40.42 R9.1 15.96,47.54 JP3.6
SCK
  Top 0.254: U1.6 21.08,45.85 21.97,46.74 27.3,46.74 | 27.3,46.74 27.94,47.37 JP3.11 | IC1.1 37.58,42.56 33.66,46.48 27.56,46.48 27.3,46.74
SH1  (via drill 0.35)
  Top 0.254: IC2.18 62.84,18.5 64.05,17.3 67.54,17.3 72.01,12.83 80.52,12.83 80.98,13.29 U$4.9
  other vias: 82.55,17.27 82.55,16.13 82.55,14.99 82.55,13.84 81.53,13.84 81.53,14.99 81.53,16.13 81.53,17.27 80.52,17.27 79.5,17.27 79.5,16.13 80.52,16.13 80.52,14.99 79.5,14.99 79.5,13.84 80.52,13.84 82.17,19.43 89.79,19.68 87.12,19.05 86.11,18.54 84.58,17.14 91.06,17.78 92.46,19.81 91.82,21.21 87.38,20.57 89.03,18.41 92.84,18.16
  pour Top (no thermals): 78.74,17.65 78.74,11.81 83.95,11.81 85.09,12.95 85.09,14.61 85.85,15.37 92.71,15.37 93.98,16.64 93.98,24.64 93.47,25.15 80.26,25.15 79.88,24.77 79.88,24.64 79.63,24.38 79.63,18.54
  pour Bottom (no thermals): 79.25,12.83 84.45,12.83 84.96,13.34 84.96,15.24 85.34,15.62 85.72,16 92.33,16 93.09,16 93.85,16.76 93.85,24.51 93.47,24.89 93.22,25.15 81.41,25.15 80.26,25.15 79.76,24.64 79.63,24.51 79.63,18.54 78.74,17.65 78.74,12.95 78.87,12.83
SH2  (via drill 0.35)
  Top 0.254: IC2.23 63.61,22.99 64.64,22.99 72.52,30.86 76.2,30.86 76.58,31.24 U$2.9
  other vias: 74.93,34.04 76.07,34.04 77.22,34.04 78.36,34.04 78.36,33.02 77.22,33.02 76.07,33.02 74.93,33.02 74.93,32 76.07,32 77.22,32 78.36,32 78.36,30.99 77.22,30.99 76.07,30.99 74.93,30.99 86.23,30.48 89.92,31.62 91.57,32.64 91.31,33.91 89.53,33.15 88.77,30.23 83.82,31.5 81.41,31.5 81.15,33.27 91.95,31.5 88.01,31.88 82.93,32.51 80.64,26.54 82.3,25.91 93.09,34.42 89.66,34.29 80.64,34.54
  pour Top (no thermals): 73.28,30.48 73.28,35.05 73.53,35.31 93.73,35.31 93.85,35.18 93.85,25.78 93.6,25.53 80.26,25.53 79.76,26.04 79.76,30.48
  pour Bottom (no thermals): 73.28,30.48 79.63,30.48 79.88,30.23 79.88,26.67 80.9,25.65 93.6,25.65 93.73,25.78 93.73,35.05 93.6,35.18 73.66,35.18 73.28,34.8
SLEEP
  Top 0.254: JP4.11 25.4,26.16 27.03,24.54 47.01,24.54 49.05,22.5 49.05,16.87 52.32,13.59 56.9,13.59 58.67,15.37 58.67,16.64 60.34,18.31 IC2.13
SNSOUT  (via drill 0.35)
  Top 0.254: IC2.10 57.53,21.98 56.77,21.21 v55.75,21.21 54.7,21.21 R1.1 | JP4.18 9.02,29.59 23.37,29.59 24,28.96 24,26.92 26.8,24.13 44.96,24.13 v47.88,21.21
  Bottom 0.254: v47.88,21.21 v55.75,21.21
SO  (via drill 0.35)
  Top 0.254: R6.1 R5.2 44.22,27.95 44.22,30.53 43.31,31.44 37.43,31.44 36.07,32.81 v36.07,41.02
  Bottom 0.254: v36.07,41.02 36.07,43.81 38.1,45.85 JP3.15
SP  (via drill 0.35)
  Top 0.254: IC2.21 64.84,21.98 69.89,27.03 75.6,27.03 R3.2
  other vias: 75.95,25.4 75.82,24 76.33,22.86 75.56,21.21 76.33,20.32 75.56,19.3 77.85,21.84 77.85,20.83 77.85,19.81 75.69,15.88 76.83,16.13 75.56,14.61 76.71,14.86 76.96,18.41 77.98,25.91 77.98,24.77 77.98,23.5
  pour Top (rank 2, no thermals): 74.93,14.1 78.61,14.1 78.61,17.53 79.5,18.41 79.5,27.05 77.85,27.05 77.85,30.23 73.28,30.23 73.28,27.94 74.93,27.94
  pour Bottom: 73.15,29.97 73.15,28.19 73.41,27.94 74.93,25.91 74.93,14.1 78.23,14.1 78.23,17.65 79.25,18.67 79.25,29.84 79.12,29.97
VIN  (via drill 0.35)
  other vias: 45.97,11.43 46.99,11.43 48.01,11.43 49.02,11.43 49.02,10.29 48.01,10.29 46.99,10.29 45.97,10.29 45.97,9.14 46.99,9.14 48.01,9.14 49.02,9.14 49.02,8 48.01,8 46.99,8 45.97,8 83.57,39.12 84.71,39.12 85.85,39.12 87,39.12 87,38.1 85.85,38.1 84.71,38.1 83.57,38.1 83.57,37.08 84.71,37.08 85.85,37.08 87,37.08 87,36.07 85.85,36.07 84.71,36.07 83.57,36.07 86.87,14.35 88.01,14.35 89.15,14.35 90.3,14.35 90.3,13.34 89.15,13.34 88.01,13.34 86.87,13.34 86.87,12.32 88.01,12.32 89.15,12.32 90.3,12.32 90.3,11.3 89.15,11.3 88.01,11.3 86.87,11.3 84.33,7.37 92.58,8.13 95.12,14.73 97.66,17.91 95.5,26.04 98.04,21.34 97.28,27.3 96.27,37.34 88.14,41.27 77.09,38.61 79.25,40.89 75.69,40.39 75.56,42.29 78.11,39.24 79.76,38.61 81.79,37.08 92.33,37.08 96.52,32.26 95.38,28.96 97.79,29.84 97.92,39.75 91.06,40.13 87.5,8 80.52,8.89 57.78,9.27 54.61,6.1 57.4,5.59 53.72,9.02 89.92,9.14 89.53,6.6 85.85,5.71 93.85,11.3 93.09,13.46
  pour Top (rank 3, no thermals): 45.34,11.94 45.34,7.11 48.13,7.11 49.15,6.1 49.15,4.7 89.92,4.7 99.06,13.84 99.06,41.02 98.68,41.4 90.93,41.4 88.77,43.56 75.18,43.56 64.77,33.15 64.77,27.69 62.61,25.53 62.61,23.75 64.26,23.75 70.99,30.48 70.99,33.91 72.64,35.56 93.98,35.56 94.36,35.18 94.36,15.88 93.73,15.24 86.23,15.24 85.6,14.61 85.6,12.57 84.2,11.18 53.85,11.18 52.58,12.45 45.85,12.45
  pour Bottom (no thermals): 45.47,6.6 47.24,4.83 90.17,4.83 98.93,13.59 98.93,41.15 98.55,41.53 90.81,41.53 88.77,43.56 75.06,43.56 74.17,42.67 74.17,37.34 75.82,35.69 93.73,35.69 94.49,34.92 94.49,15.37 93.98,14.86 86.23,14.86 85.6,14.22 85.6,12.57 84.33,11.3 53.98,11.3 52.58,12.7 45.47,12.7

### Text on the board
tNames: +3V3 | +5V | SPEAR | MOTOR CONTROLLER 30A | V1.1 | minh7a6 | +